# Altium schematic sheet micro_avr_tiny_48_88_tqfp32.SchDoc
size A
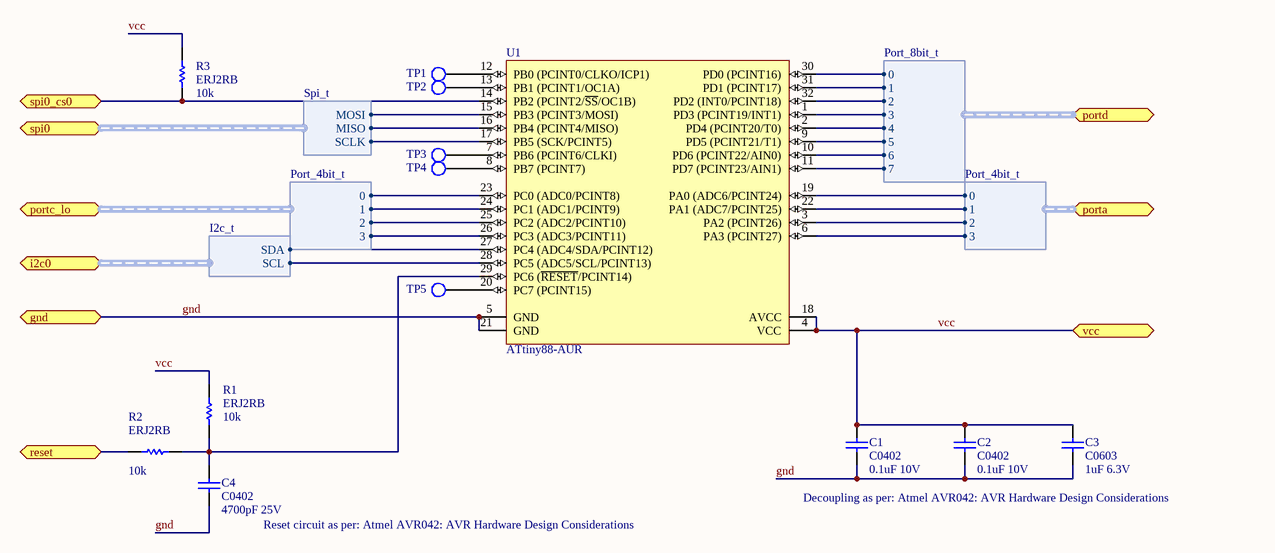
[diagram p0: micro_avr_tiny_48_88_tqfp32.SchDoc]

## Parts
C1  C0402  value 0.1uF 10V  [0402]
C2  C0402  value 0.1uF 10V  [0402]
C3  C0603  value 1uF 6.3V  [0603]
C4  C0402  value 4700pF 25V  [0402]
R1  ERJ2RB  value 10k  [2-0402]
R2  ERJ2RB  value 10k  [2-0402]
R3  ERJ2RB  value 10k  [2-0402]
TP1  Component_1  [PCBComponent_1]  (value not drawn)
TP2  Component_1  [PCBComponent_1]  (value not drawn)
TP3  Component_1  [PCBComponent_1]  (value not drawn)
TP4  Component_1  [PCBComponent_1]  (value not drawn)
TP5  Component_1  [PCBComponent_1]  (value not drawn)
U1  ATtiny88-AUR  [32A_N]

## Ports
gnd, i2c0 (harness I2c_t), porta (harness Port_4bit_t), portc_lo (harness Port_4bit_t), portd (harness Port_8bit_t), reset, spi0 (harness Spi_t), spi0_cs0, vcc

## Harnesses
Port_4bit_t: 0, 1, 2, 3
I2c_t: SDA, SCL
Port_8bit_t: 0, 1, 2, 3, 4, 5, 6, 7
Spi_t: MISO, MOSI, SCLK

## Nets
gnd: C1.2 C2.2 C3.1 C4.2 U1.5(GND) U1.21(GND) ; port gnd
reset: R2.2 ; port reset
spi0_cs0: R3.1 U1.14(PB2_(PCINT2/~{SS}/OC1B)) ; port spi0_cs0
vcc: C1.1 C2.1 C3.2 R1.2 R3.2 U1.4(VCC) U1.18(AVCC) ; port vcc
NetC4_1: C4.1 R1.1 R2.1 U1.29(PC6_(~{RESET}/PCINT14))
NetTP1_1: TP1.1 U1.12(PB0_(PCINT0/CLKO/ICP1))
NetTP2_1: TP2.1 U1.13(PB1_(PCINT1/OC1A))
NetTP3_1: TP3.1 U1.7(PB6_(PCINT6/CLKI))
NetTP4_1: TP4.1 U1.8(PB7_(PCINT7))
NetTP5_1: TP5.1 U1.20(PC7_(PCINT15))
NetU1_1: U1.1(PD3_(PCINT19/INT1)) ; port portd.3
NetU1_2: U1.2(PD4_(PCINT20/T0)) ; port portd.4
NetU1_3: U1.3(PA2_(PCINT26)) ; port porta.2
NetU1_6: U1.6(PA3_(PCINT27)) ; port porta.3
NetU1_9: U1.9(PD5_(PCINT21/T1)) ; port portd.5
NetU1_10: U1.10(PD6_(PCINT22/AIN0)) ; port portd.6
NetU1_11: U1.11(PD7_(PCINT23/AIN1)) ; port portd.7
NetU1_15: U1.15(PB3_(PCINT3/MOSI)) ; port spi0.MOSI
NetU1_16: U1.16(PB4_(PCINT4/MISO)) ; port spi0.MISO
NetU1_17: U1.17(PB5_(SCK/PCINT5)) ; port spi0.SCLK
NetU1_19: U1.19(PA0_(ADC6/PCINT24)) ; port porta.0
NetU1_22: U1.22(PA1_(ADC7/PCINT25)) ; port porta.1
NetU1_23: U1.23(PC0_(ADC0/PCINT8)) ; port portc_lo.0
NetU1_24: U1.24(PC1_(ADC1/PCINT9)) ; port portc_lo.1
NetU1_25: U1.25(PC2_(ADC2/PCINT10)) ; port portc_lo.2
NetU1_26: U1.26(PC3_(ADC3/PCINT11)) ; port portc_lo.3
NetU1_27: U1.27(PC4_(ADC4/SDA/PCINT12)) ; port i2c0.SDA
NetU1_28: U1.28(PC5_(ADC5/SCL/PCINT13)) ; port i2c0.SCL
NetU1_30: U1.30(PD0_(PCINT16)) ; port portd.0
NetU1_31: U1.31(PD1_(PCINT17)) ; port portd.1
NetU1_32: U1.32(PD2_(INT0/PCINT18)) ; port portd.2

## Notes on the sheet
- Decoupling as per: Atmel AVR042: AVR Hardware Design Considerations
- Reset circuit as per: Atmel AVR042: AVR Hardware Design Considerations

## Library data of the parts
C1 C2 C4 = C0402: Ceramic Chip Capacitor - Standard; Note: Footprint corresponds to dimensions for bulk cassette packaging. This case size has tightened tolerances.; Published: 17-Jul-2002; LatestRevisionDate: 19-Mar-2004; LatestRevisionNote: Silkscreen size reduced.; DatasheetDocument: Mar-2001; PackageDocument: Mar-2001; PackageReference: 0402; Publisher: Altium Limited; Code_JEITA: 0402; Code_IPC: 1005 [0402]; ComponentLink1Description: Manufacturer Link; ComponentLink1URL: http://www.kemet.com/; ComponentLink2Description: Datasheet; ComponentLink2URL: http://www.kemet.com/kemet/web/homepage/kechome.nsf/vapubfilesname/F3102TA.pdf/$file/F3102TA.pdf
C3 = C0603: Ceramic Chip Capacitor - Standard; Note: Footprint corresponds to dimensions for bulk cassette packaging. This case size has tightened tolerances.; Published: 17-Jul-2002; LatestRevisionDate: 19-Mar-2004; LatestRevisionNote: Silkscreen size reduced.; DatasheetDocument: Mar-2001; PackageDocument: Mar-2001; PackageReference: 0603; Publisher: Altium Limited; Code_JEITA: 0603; Code_IPC: 1608 [0603]; ComponentLink1Description: Manufacturer Link; ComponentLink1URL: http://www.kemet.com/; ComponentLink2Description: Datasheet; ComponentLink2URL: http://www.kemet.com/kemet/web/homepage/kechome.nsf/vapubfilesname/F3102TA.pdf/$file/F3102TA.pdf
R1-R3 = ERJ2RB: Precision Thick Film Chip Resistor, 10 Ohm to 1M Ohm Range, 1% and 0.5% Tolerance, 0402 Size, 0.063 W; Published: 17-Dec-2003; LatestRevisionDate: 19-Mar-2004; LatestRevisionNote: Silkscreen size reduced.; PackageDocument: Mar-2003; PackageReference: 2-0402; Publisher: Altium Limited; Code_IPC: 1005 [0402]; ComponentLink1Description: Manufacturer Link; ComponentLink1URL: http://www.panasonic.com/industrial/components/resistive_products.htm; ComponentLink2Description: Datasheet; ComponentLink2URL: http://www.panasonic.com/industrial/components/pdf/AOA0000CE2.pdf
U1 = ATtiny88-AUR: 8-bit AVR Microcontroller, 1.8-5.5V, 12MHz, 8KB Flash, 64 Bytes EEPROM, 512 Bytes SRAM, 32-pin TQFP, Industrial Grade (-40°C to 85°C), Pb-Free, Reel; DatasheetVersion: revC, Mar-2009; PackageVersion: revC, Oct-2010; PackageReference: 32A; PackageDescription: 32-Lead, 7x7x1.0 mm Body, 0.8mm Lead Pitch, Thin Profile Plastic Quad Flat Package (TQFP); Code_JEDEC: MS-026-ABA; ComponentLink1Description: Manufacturer URL; ComponentLink1URL: http://www.atmel.com/; ComponentLink2Description: ATtiny48/88 Datasheet; ComponentLink2URL: http://www.atmel.com/dyn/resources/prod_documents/doc8008.pdf; ComponentLink3Description: ATtiny48/88 Summary; ComponentLink3URL: http://www.atmel.com/dyn/resources/prod_documents/8008S.pdf